# EAGLE design Ambiente_superior (EAGLE 7.6.0)
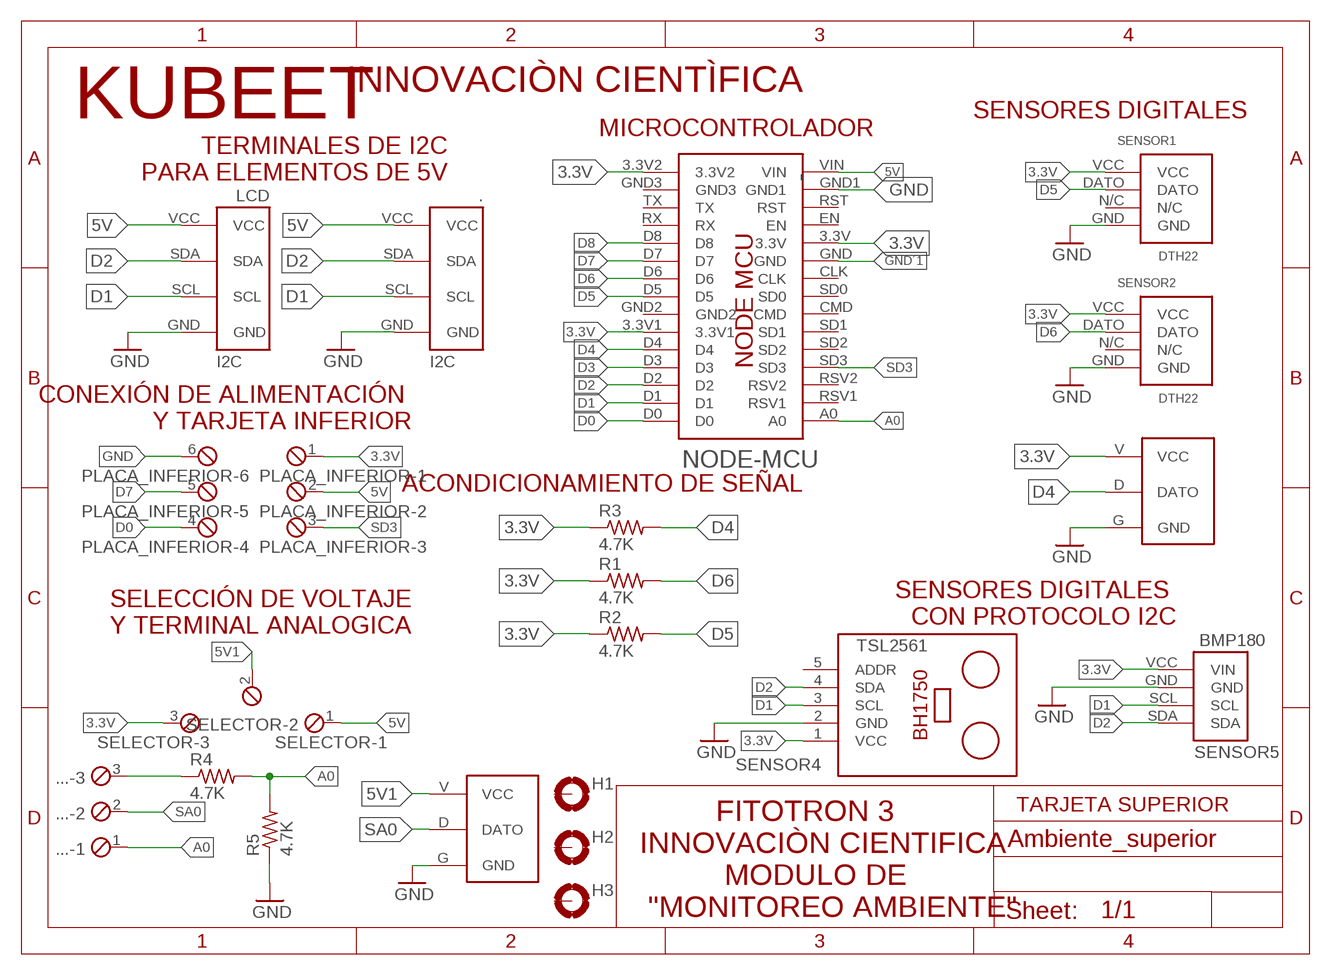
[diagram p0: schematic, sheet 1]

## Parts
-  NODE-MCU  [NODE-MCU]
.  I2C  [I2C]
..  LM35  [LM35]
...  MPT3  [3POL254]
H1  MOUNT-PAD-ROUND3.6  [3,6-PAD]
H2  MOUNT-PAD-ROUND3.6  [3,6-PAD]
H3  MOUNT-PAD-ROUND3.6  [3,6-PAD]
LCD  I2C  [I2C]
PLACA_INFERIOR  MPT6  [6POL254]
R1  4.7K  R-US_0207/7  [0207/7]
R2  4.7K  R-US_0207/7  [0207/7]
R3  4.7K  R-US_0207/7  [0207/7]
R4  4.7K  R-US_0207/7  [0207/7]
R5  4.7K  R-US_0207/7  [0207/7]
SELECTOR  MPT3  [3POL254]
SENSOR1  DTH22  [DTH22]
SENSOR2  DTH22  [DTH22]
SENSOR3  DS18B20  LM35  [LM35]
SENSOR4  TSL2561  LIGHT-SENSOR-BH1750  [LIGHT-SENSOR-BH1750]
SENSOR5  BMP180  [BMP180]

## Nets
3.3V: -.3.3V -.3.3V1 -.3.3V2 PLACA_INFERIOR.1 R1.1 R2.1 R3.1 SELECTOR.3 SENSOR1.VCC SENSOR2.VCC SENSOR3.V(VCC) SENSOR4.1(VCC) SENSOR5.VCC(VIN)
5V: -.VIN ..VCC LCD.VCC PLACA_INFERIOR.2 SELECTOR.1
5V1: ...V(VCC) SELECTOR.2
A0: -.A0 ....1 R4.2 R5.2
D0: -.D0 PLACA_INFERIOR.4
D1: -.D1 ..SCL LCD.SCL SENSOR4.3(SCL) SENSOR5.SCL
D2: -.D2 ..SDA LCD.SDA SENSOR4.4(SDA) SENSOR5.SDA
D3: -.D3
D4: -.D4 R3.2 SENSOR3.D(DATO)
D5: -.D5 R2.2 SENSOR1.DATO
D6: -.D6 R1.2 SENSOR2.DATO
D7: -.D7 PLACA_INFERIOR.5
D8: -.D8
GND: -.GND1 ...G(GND) ..GND LCD.GND PLACA_INFERIOR.6 R5.1 SENSOR1.GND SENSOR2.GND SENSOR3.G(GND) SENSOR4.2(GND) SENSOR5.GND
GND´1: -.GND
N$142: ....3 R4.1
SA0: ....2 ...D(DATO)
SD3: -.SD3 PLACA_INFERIOR.3
Unconnected: -.CLK -.CMD -.EN -.GND2 -.GND3 -.RST -.RSV1 -.RSV2 -.RX -.SD0 -.SD1 -.SD2 -.TX H1.B3,6(MOUNT) H2.B3,6(MOUNT) H3.B3,6(MOUNT) SENSOR1.N/C SENSOR2.N/C SENSOR4.5(ADDR)

## Notes on the sheet
- INNOVACIÒN CIENTÌFICA
- SENSORES DIGITALES
- KUBEET | MICROCONTROLADOR
- TERMINALES DE I2C
  PARA ELEMENTOS DE 5V
- CONEXIÓN DE ALIMENTACIÓN 
       Y TARJETA INFERIOR
- ACONDICIONAMIENTO DE SEÑAL
- SENSORES DIGITALES 
  CON PROTOCOLO I2C
- SELECCIÓN DE VOLTAJE
  Y TERMINAL ANALOGICA
- TARJETA SUPERIOR
- FITOTRON 3
  INNOVACIÒN CIENTIFICA
            MODULO DE 
   "MONITOREO AMBIENTE"

## Library data of the parts
- = Arduinos:NODE-MCU
. LCD = CONECTORES RODAS:I2C
.. SENSOR3 = Sensores y transmisores:LM35
... SELECTOR = con-phoenix-254:MPT3: PHOENIX CONNECTOR; OC_FARNELL: unknown; OC_NEWARK: unknown
H1-H3 = holes:MOUNT-PAD-ROUND: MOUNTING PAD, round
PLACA_INFERIOR = con-phoenix-254:MPT6: PHOENIX CONNECTOR; OC_FARNELL: unknown; OC_NEWARK: unknown
R1-R5 = rcl:R-US_: RESISTOR, American symbol
SENSOR1 SENSOR2 = Sensores y transmisores:DTH22
SENSOR4 = Modulos:LIGHT-SENSOR-BH1750: Digital Light Sensor based on BH1750 BH1750 datasheet is available here: http://www.mouser.com/ds/2/348/bh1750fvi-e-186247.pdf Arduino Library for BH1750 is available here: https://github.com/claws/BH1750 Video Tutorial is available here: https://www.youtube.com/watch?v=UsLcHSbxf_8 Click here to find device on ebay.com <http://www.ebay.com/sch/bh1750fvi+module> Note: There are many variants. Search for the proper version.
SENSOR5 = Sensores y transmisores:BMP180

## Board
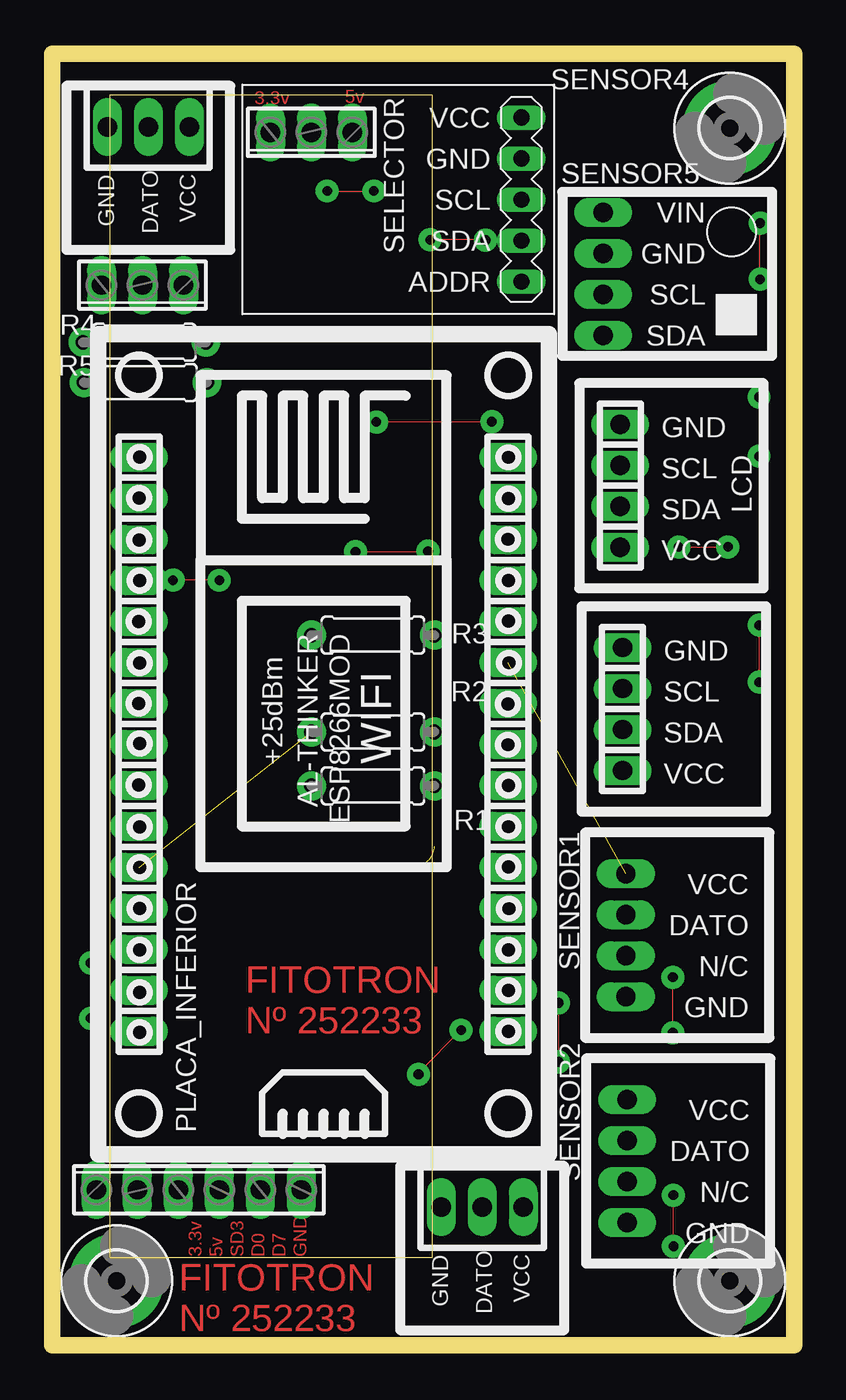
[diagram p1: board, top side]
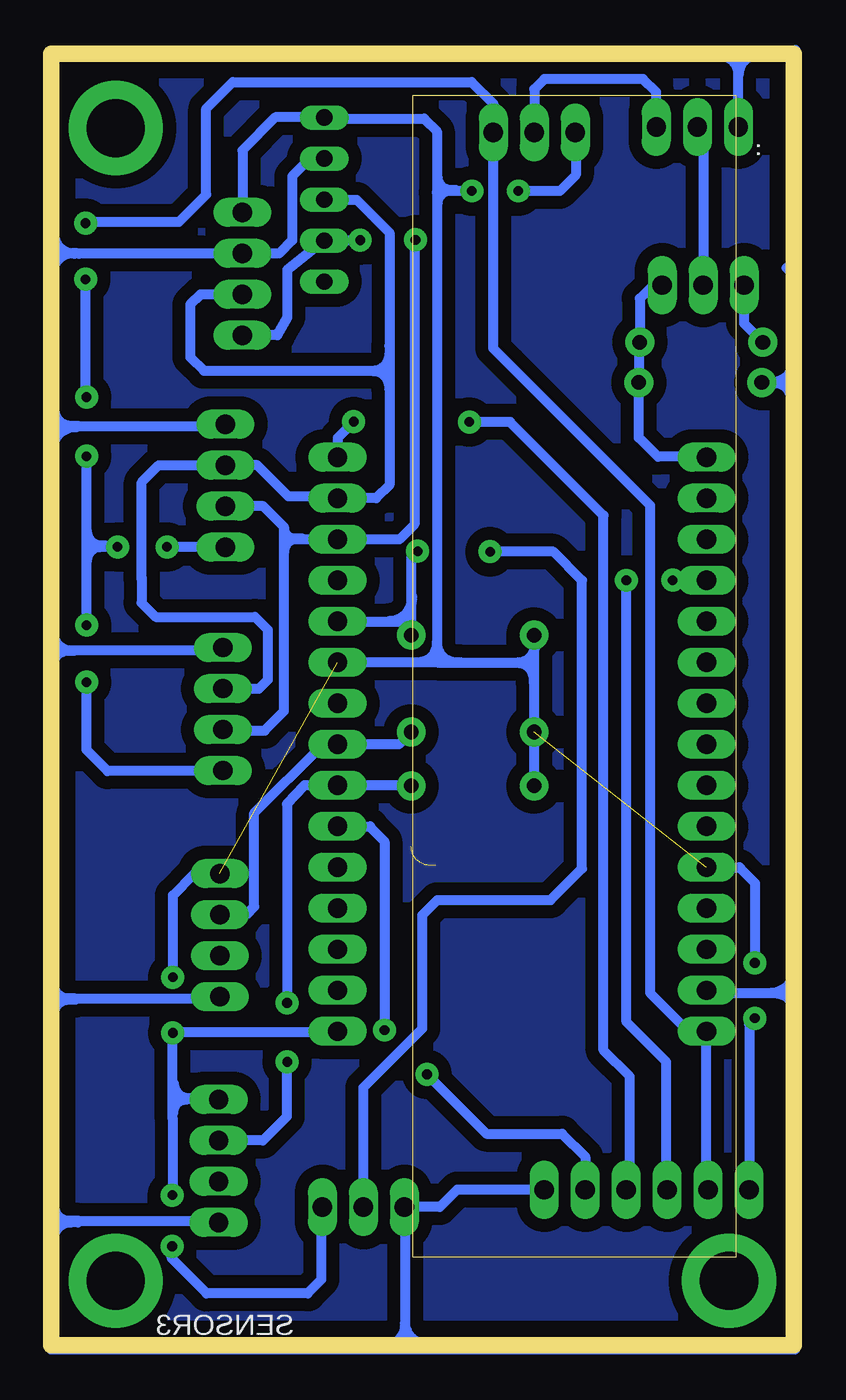
[diagram p2: board, bottom side, seen from below]

Size 46 x 80 mm. Coordinates in mm from the lower left corner, seen from the top.
Outline: 0,0 46,0 46,80 0,80 0,0
Copper layers (1*16): Top 0.035mm / dielectric 1.5mm / Bottom 0.035mm
Design rules "default": minimum track width 10mil, minimum drill 24mil, track to track 8mil, track to pad 8mil, pad to pad 8mil, via to via 8mil, smd to smd 8mil, copper to edge 40mil, drill to drill 8mil, minimum pad ring 10mil, minimum via ring 8mil, stop-mask expansion 4mil, vias tented up to drill 0mil, thermal gap 10mil
Milling: area 3.6,5.5 to 23.6,77.5

### Footprints (pad centres in the part's own frame; a part is rotated, then mirrored left to right if it is on the bottom)
NODE-MCU = drill 1.2 pad 1.676 long: 3.3V 2.54,17.78; 3.3V1 25.4,30.48; 3.3V2 25.4,7.62; A0 2.54,43.18; CLK 2.54,22.86; CMD 2.54,27.94; D0 25.4,43.18; D1 25.4,40.64; D2 25.4,38.1; D3 25.4,35.56; D4 25.4,33.02; D5 25.4,25.4; D6 25.4,22.86; D7 25.4,20.32; D8 25.4,17.78; EN 2.54,15.24; GND 2.54,20.32; GND1 2.54,10.16; GND2 25.4,27.94; GND3 25.4,10.16; RST 2.54,12.7; RSV1 2.54,40.64; RSV2 2.54,38.1; RX 25.4,15.24; SD0 2.54,25.4; SD1 2.54,30.48; SD2 2.54,33.02; SD3 2.54,35.56; TX 25.4,12.7; VIN 2.54,7.62
I2C = drill 1.2 pad 1.676 long: GND 2.54,10.16; SCL 2.54,7.62; SDA 2.54,5.08; VCC 2.54,2.54
LM35 = drill 1.2 pad 1.778 long: D 5.08,2.54; G 7.62,2.54; V 2.54,2.54
3POL254 = drill 1.2 long: 1 -2.54,0; 2 0,0; 3 2.54,0
3,6-PAD = drill 3.6 pad 5.842: B3,6 0,0
6POL254 = drill 1.2 pad 1.778 long: 1 -6.35,0; 2 -3.81,0; 3 -1.27,0; 4 1.27,0; 5 3.81,0; 6 6.35,0
0207/7 = drill 0.9 pad 1.778: 1 -3.81,0; 2 3.81,0
DTH22 = drill 1.2 pad 1.778 long: DATO 5.08,2.54; GND 10.16,2.54; N/C 7.62,2.54; VCC 2.54,2.54
LIGHT-SENSOR-BH1750 = drill 1 pad 1.422 long: 1 -7.62,-5.08; 2 -7.62,-2.54; 3 -7.62,0; 4 -7.62,2.54; 5 -7.62,5.08
BMP180 = drill 1.2 pad 1.778 long: GND 3.81,2.54; SCL 6.35,2.54; SDA 8.89,2.54; VCC 1.27,2.54

### Placement (x,y rotation side)
-  2.86,11.84 0 top
.  32.81,33.07 0 top
..  11.04,78.03 180 top
...  5.6,65.68 180 top
H1  42,4 0 top
H2  4,4 0 top
H3  42,75.41 0 top
LCD  32.67,46.9 0 top
PLACA_INFERIOR  9.1,9.64 0 top
R1  19.89,34.66 0 top
R2  19.89,38 0 top
R3  19.89,44 0 top
R4  5.72,62.14 0 top
R5  5.78,59.65 0 top
SELECTOR  16.07,75.14 180 top
SENSOR1  33.02,31.76 270 top
SENSOR2  33.08,17.77 270 top
SENSOR3  31.73,11.11 180 top
SENSOR4  21.46,70.98 180 top
SENSOR5  31.61,71.46 270 top

### Tracks (layer width: path | path; a pad name or v marks a point on that pad's centre or on a via)
3.3V  (via drill 0.6 pad 1.42)  (2 unrouted)
  Top 0: v38.51,6.14 38.5,6.54 v38.5,9.31 | v38.46,19.36 v38.46,22.8 | v17.05,71.52 v19.94,71.52 | v2.4,23.69 v2.4,20.27
  Bottom 0.61: SENSOR5.VCC 34.15,74.04 32.11,76.08 29.09,76.08 SENSOR4.1 29.01,76 22.89,76 22.1,75.2 22.1,71.42 | SENSOR3.V 29.27,8.5 29.27,4.08 30.11,3.23 36.38,3.23 38.53,5.38 v38.51,6.14 | v38.5,9.31 38.46,9.35 38.46,14 38.46,14.01 38.46,15.05 | 38.46,15.05 v38.46,19.36 38.46,19.38 28.33,19.38 -.3.3V2 | v38.46,22.8 v38.46,22.81 38.46,27.88 37.11,29.22 SENSOR1.VCC | SENSOR2.VCC 38.28,15.23 arc-90 38.46,15.05 | R2.1 R1.1 16.08,41.95 | 22.1,42.31 -.3.3V1 | 22.1,71.42 22.1,42.31 | SELECTOR.3 13.49,75.11 13.49,72.5 14.48,71.52 v17.05,71.52 | v19.94,71.52 22,71.52 arc-90 22.1,71.42 | -.3.3V 3.92,29.61 | 3.92,29.61 arc-90 3.92,29.61 | 3.92,29.61 3.38,29.61 arc90 3.28,29.52 2.4,28.64 v2.4,23.69 | v2.4,20.27 2.75,19.92 PLACA_INFERIOR.1 | R3.1 16.08,41.95 | 22.1,42.31 16.44,42.31 16.08,41.95
5V  (via drill 0.6 pad 1.42)
  Top 0: v43.81,41.09 v43.81,44.61 | v43.81,55.08 v43.81,58.74 | v43.87,66.04 43.85,66.06 43.85,68.8 43.87,68.82 v43.87,69.52 | v38.83,49.46 v41.89,49.46
  Bottom 0.61: ..VCC 35.39,35.57 42.5,35.57 43.81,36.89 v43.81,41.09 | v43.81,44.61 v43.81,44.62 43.81,49.46 | 43.81,49.46 v43.81,55.08 | v43.81,58.74 43.87,58.81 v43.87,66.04 | v43.87,69.52 43.78,69.61 38.07,69.61 36.39,71.3 36.39,76.62 34.75,78.26 19.95,78.26 18.61,76.92 SELECTOR.1 18.61,61.75 8.9,52.04 8.9,21.85 6.51,19.45 -.VIN 5.4,9.74 arc-90 PLACA_INFERIOR.2 | LCD.VCC 35.23,49.46 v38.83,49.46 | v41.89,49.46 43.81,49.46
5V1
  Bottom 0.61: ...V 8.51,75.5 8.51,77.64 9.33,78.45 15.44,78.45 16.07,77.83 SELECTOR.2
A0
  Bottom 0.61: -.A0 5.44,55.05 8.41,55.05 9.59,56.23 R5.2 9.59,62.08 R4.2 9.53,64.86 8.7,65.68 ....1 | ....1
D0  (via drill 0.6 pad 1.42)
  Top 0: v20.09,57.2 20.11,57.22 v27.25,57.22
  Bottom 0.61: PLACA_INFERIOR.4 10.15,9.86 10.15,16.66 11.77,18.29 11.77,51.41 17.56,57.2 v20.09,57.2 | v27.25,57.22 28.26,56.22 -.D0
D1
  Bottom 0.61: ..SCL 33.13,40.69 arc-90 33.1,40.72 32.59,41.23 32.59,44.33 33.38,45.12 39.52,45.12 40.4,46 40.4,47.5 40.39,47.51 40.39,53.47 39.33,54.52 LCD.SCL 33.23,54.52 31.3,52.59 28.37,52.59 -.D1 25.86,52.48 25.04,53.29 25.04,60.37 | 25.04,60.37 25.04,68.93 27.08,70.97 29.06,70.97 SENSOR4.3 | SENSOR5.SCL 36.77,65.1 37.38,64.49 37.38,61.22 36.53,60.37 25.04,60.37
D2  (via drill 0.6 pad 1.42)
  Top 0: v26.86,68.46 26.31,68.49 v23.43,68.49
  Bottom 0.61: ..SDA 35.29,38.09 32.77,38.09 31.57,39.29 31.57,50.05 | 31.57,50.05 31.57,50.7 32.86,51.98 LCD.SDA | 31.57,50.05 arc-90 31.46,49.94 -.D2 24.42,49.94 23.5,50.86 23.5,68.42 v23.43,68.49 | SENSOR5.SDA 32,62.57 31.38,63.68 31.38,66.62 SENSOR4.4 29.11,68.47 v26.86,68.46
D4  (via drill 0.6 pad 1.42)
  Top 0: v18.81,49.17 23.27,49.17 v23.29,49.2
  Bottom 0.61: -.D4 23.74,44.85 arc90 23.7,44.81 | SENSOR3.D 26.65,15.98 23,19.64 23,26.66 22.07,27.59 15.05,27.59 13.11,29.54 13.11,47.4 14.88,49.17 v18.81,49.17 | v23.29,49.2 23.7,48.79 23.7,44.81 | 23.7,44.81 R3.2
D5
  Bottom 0.61: SENSOR1.DATO 33.92,26.68 33.41,27.19 33.41,32.98 29.25,37.14 28.35,37.14 -.D5 24.46,37.23 R2.2
D6  (via drill 0.6 pad 1.42)
  Top 0: v31.39,21.22 31.38,20.7 v31.38,17.56
  Bottom 0.61: v31.39,21.22 31.4,33.53 30.34,34.65 arc90 30.3,34.7 -.D6 24,34.7 R1.2 | v31.38,17.56 31.41,17.53 31.41,14.17 32.88,12.7 SENSOR2.DATO
D7  (via drill 0.6 pad 1.42)
  Top 0: v25.35,19.53 22.71,16.89 v22.71,16.79
  Bottom 0.61: -.D7 26.23,32.16 26.23,32.11 25.35,31.23 v25.35,19.53 | v22.71,16.79 19.04,13.12 14.34,13.12 12.91,11.69 PLACA_INFERIOR.5
GND
  Bottom 0.61: LCD.GND 35.35,56.93 46.04,56.93 46.03,56.91 46.03,43.05 | 46.03,43.05 46.03,21.47 | 46.03,21.47 46.03,7.69 | 46.03,7.69 46.03,-0.24 24.07,-0.24 | 24.07,-0.24 -0.08,-0.24 -0.11,-0.21 -0.11,21.83 | -0.11,21.83 -0.11,59.65 | -0.11,59.65 -0.11,66.47 | -0.11,66.47 -0.11,80.23 0.12,80 3.42,80 | 3.42,80 46.06,80 46.06,67.64 | 46.06,67.64 46.06,57.79 | 0.44,66.75 0.17,66.47 -0.11,66.47 | SENSOR5.GND 34.16,67.64 | 34.16,67.64 46.06,67.64 | ..GND 35.54,43.05 46.03,43.05 | SENSOR1.GND 35.69,21.47 46.03,21.47 | 24.07,-0.24 24.07,8.52 SENSOR3.G 21.92,8.57 20.84,9.65 15.46,9.65 PLACA_INFERIOR.6 | SENSOR2.GND 35.7,7.69 46.03,7.69 | SENSOR4.2 29.09,73.54 29.96,73.54 31.07,72.42 31.07,68.46 31.89,67.64 34.16,67.64 | -.GND1 5.23,21.83 -0.11,21.83 | R5.1 | R5.1 -0.11,59.65 | ...G 3.42,80
N$100
  Bottom 0.61: 37.29,15.32 37.48,15.32 arc90 38.39,16.23
N$109
  Bottom 0.61: 0.01,61.31 0.01,61.02 arc90 1.4,59.64 1.26,59.64 arc90 0.12,58.5
N$110
  Bottom 0.61: 16.17,0.14 16.84,0.14
N$118
  pour Bottom (isolate 0.813): 1.03,0.62 46.28,-0.54 46.28,79.65 0.57,79.65 0.57,3.03
N$123
  Bottom 0.61: 30.42,49.97 30.91,49.97 arc90 31.57,50.63
N$124
  Bottom 0.61: 30.41,49.97 30.76,49.97 arc-90 31.57,49.17
N$125
  Bottom 0.61: 37.15,15.24 37.62,15.24 arc-90 38.44,14.42
N$126
  Bottom 0.61: 25.05,61.91 25.05,61.41 arc90 26.09,60.37 arc90 25.06,59.34 25.06,59.25
N$127  (1 unrouted)
  Bottom 0.61: -0.05,73.25 -0.05,72.35 | -0.1,70.46 -0.1,70.28
N$128
  Bottom 0.61: 44.29,67.63 44.56,67.63 arc90 45.8,68.87
N$129
  Bottom 0.61: 44.38,67.66 44.61,67.66 arc-90 45.92,66.35
N$130
  Bottom 0.61: 44.35,56.96 44.79,56.96 arc90 45.79,57.97
N$131
  Bottom 0.61: 44.45,56.88 44.47,56.88 arc-90 45.94,55.42
N$132
  Bottom 0.61: 44.6,43.04 44.71,43.04 arc90 45.84,44.1
N$133
  Bottom 0.61: 44.62,43.04 44.93,43.04 arc-90 45.9,42.07
N$134
  Bottom 0.61: 44.5,21.48 44.89,21.48 arc90 45.9,22.49
N$135
  Bottom 0.61: 44.49,21.41 44.93,21.41 arc-90 45.83,20.51
N$136
  Bottom 0.61: 44.26,7.71 44.88,7.71 arc90 45.81,8.64
N$137
  Bottom 0.61: 44.35,7.62 44.79,7.62 arc-90 45.84,6.57
N$138
  Bottom 0.61: 22.39,0.07 22.7,0.07 arc90 24.07,1.45 24.07,1.26 arc90 25.32,0.02
N$139
  Bottom 0.61: -0.03,23.69 -0.03,23.3 arc90 1.45,21.82 1.17,21.82 arc90 -0.03,20.62
N$141
  Bottom 0.61: 2.03,79.94 2.17,79.94 arc-90 3.41,78.69 arc-90 4.63,79.91
N$142
  Bottom 0.61: R4.1 3.06,63.3 ....3
N$143
  Bottom 0.61: 20.54,42.3 20.86,42.3 arc90 22.1,43.54 22.1,43.5 arc90 23.29,42.31
N$144
  Bottom 0.61: 42.58,49.53 42.87,49.53 arc90 43.77,50.44
N$145
  Bottom 0.61: 42.62,49.46 42.94,49.46 arc-90 43.78,48.62
N$147  (2 unrouted)
N$148
  Bottom 0.61: 20.94,71.57 21.23,71.57 arc90 22.07,72.41
N$149
  Bottom 0.61: 20.95,71.54 21.23,71.54 arc-90 22.08,70.69
N$150
  Bottom 0.61: 16.02,43.42 16.02,43.41 arc90 17.14,42.29 arc90 16.1,41.25 16.1,41.07
N$151
  Bottom 0.61: 23.65,46.46 23.65,46.28 arc90 25.08,44.86
SA0
  Bottom 0.61: ...D 5.6,75.12 ....2
SD3  (via drill 0.6 pad 1.42)
  Top 0: v10.36,47.4 10.34,47.41 v7.5,47.4
  Bottom 0.61: PLACA_INFERIOR.3 7.89,9.7 7.89,17.56 10.36,20.03 v10.36,47.4 | v7.5,47.4 7.77,47.4 -.SD3

### Text on the board
Top: 3.3v | 5v | FITOTRON / Nº 252233 | 3.3v | 5v | SD3 | D0 | D7 | GND | FITOTRON / Nº 252233